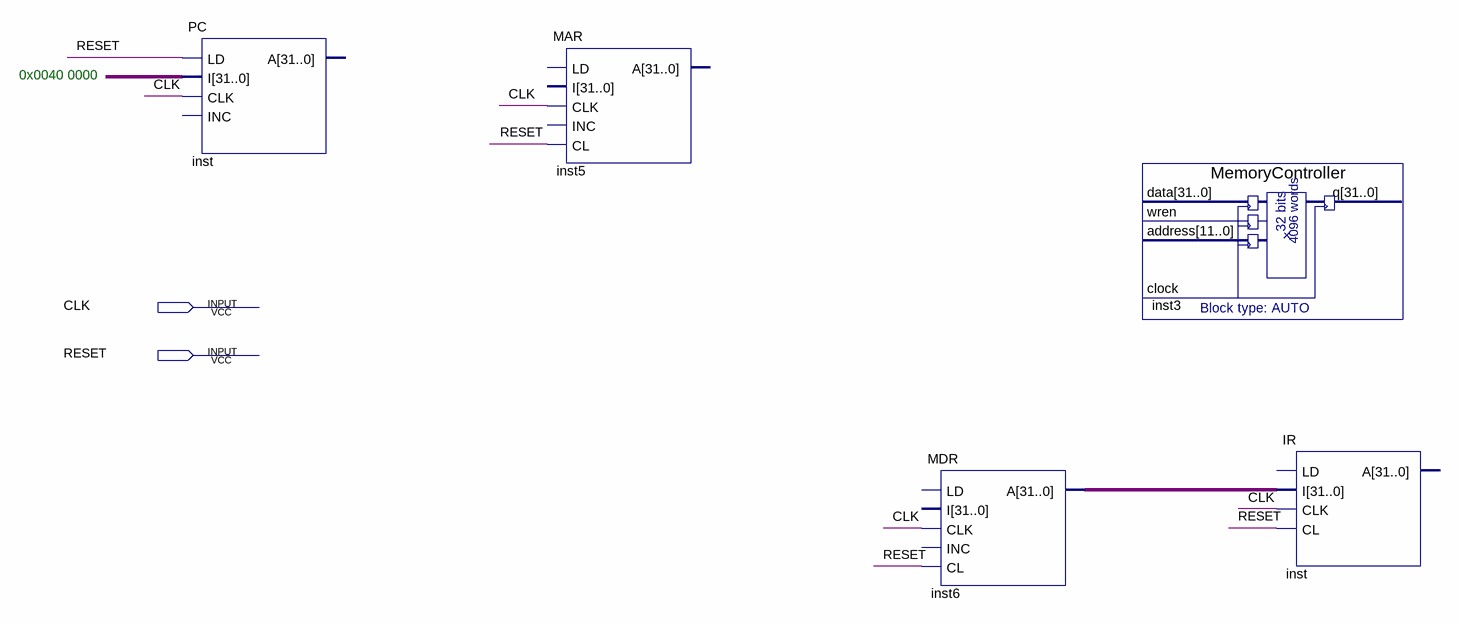
[diagram p0: schematic sheet]
// Quartus schematic OperationalUnit.bdf as structural Verilog: 5 symbols, 2 pins
module OperationalUnit (
  input  CLK,
  input  RESET
);

  wire [31:0] inst6_a, undriven;

  PC inst (.LD(RESET), .I(undriven), .CLK(CLK));  // open: INC, A
  MAR inst5 (.CLK(CLK), .CL(RESET));  // open: LD, I, INC, A
  MDR inst6 (.CLK(CLK), .CL(RESET), .A(inst6_a));  // open: LD, I, INC
  MemoryController inst3 ();  // open: data, wren, address, clock, q
  IR inst_dup2 (.I(inst6_a), .CLK(CLK), .CL(RESET));  // open: LD, A

  // Notes on the sheet:
  //   0x0040 0000
endmodule
